# EAGLE design xx_backplane_shield_xi (EAGLE 8.5.2)
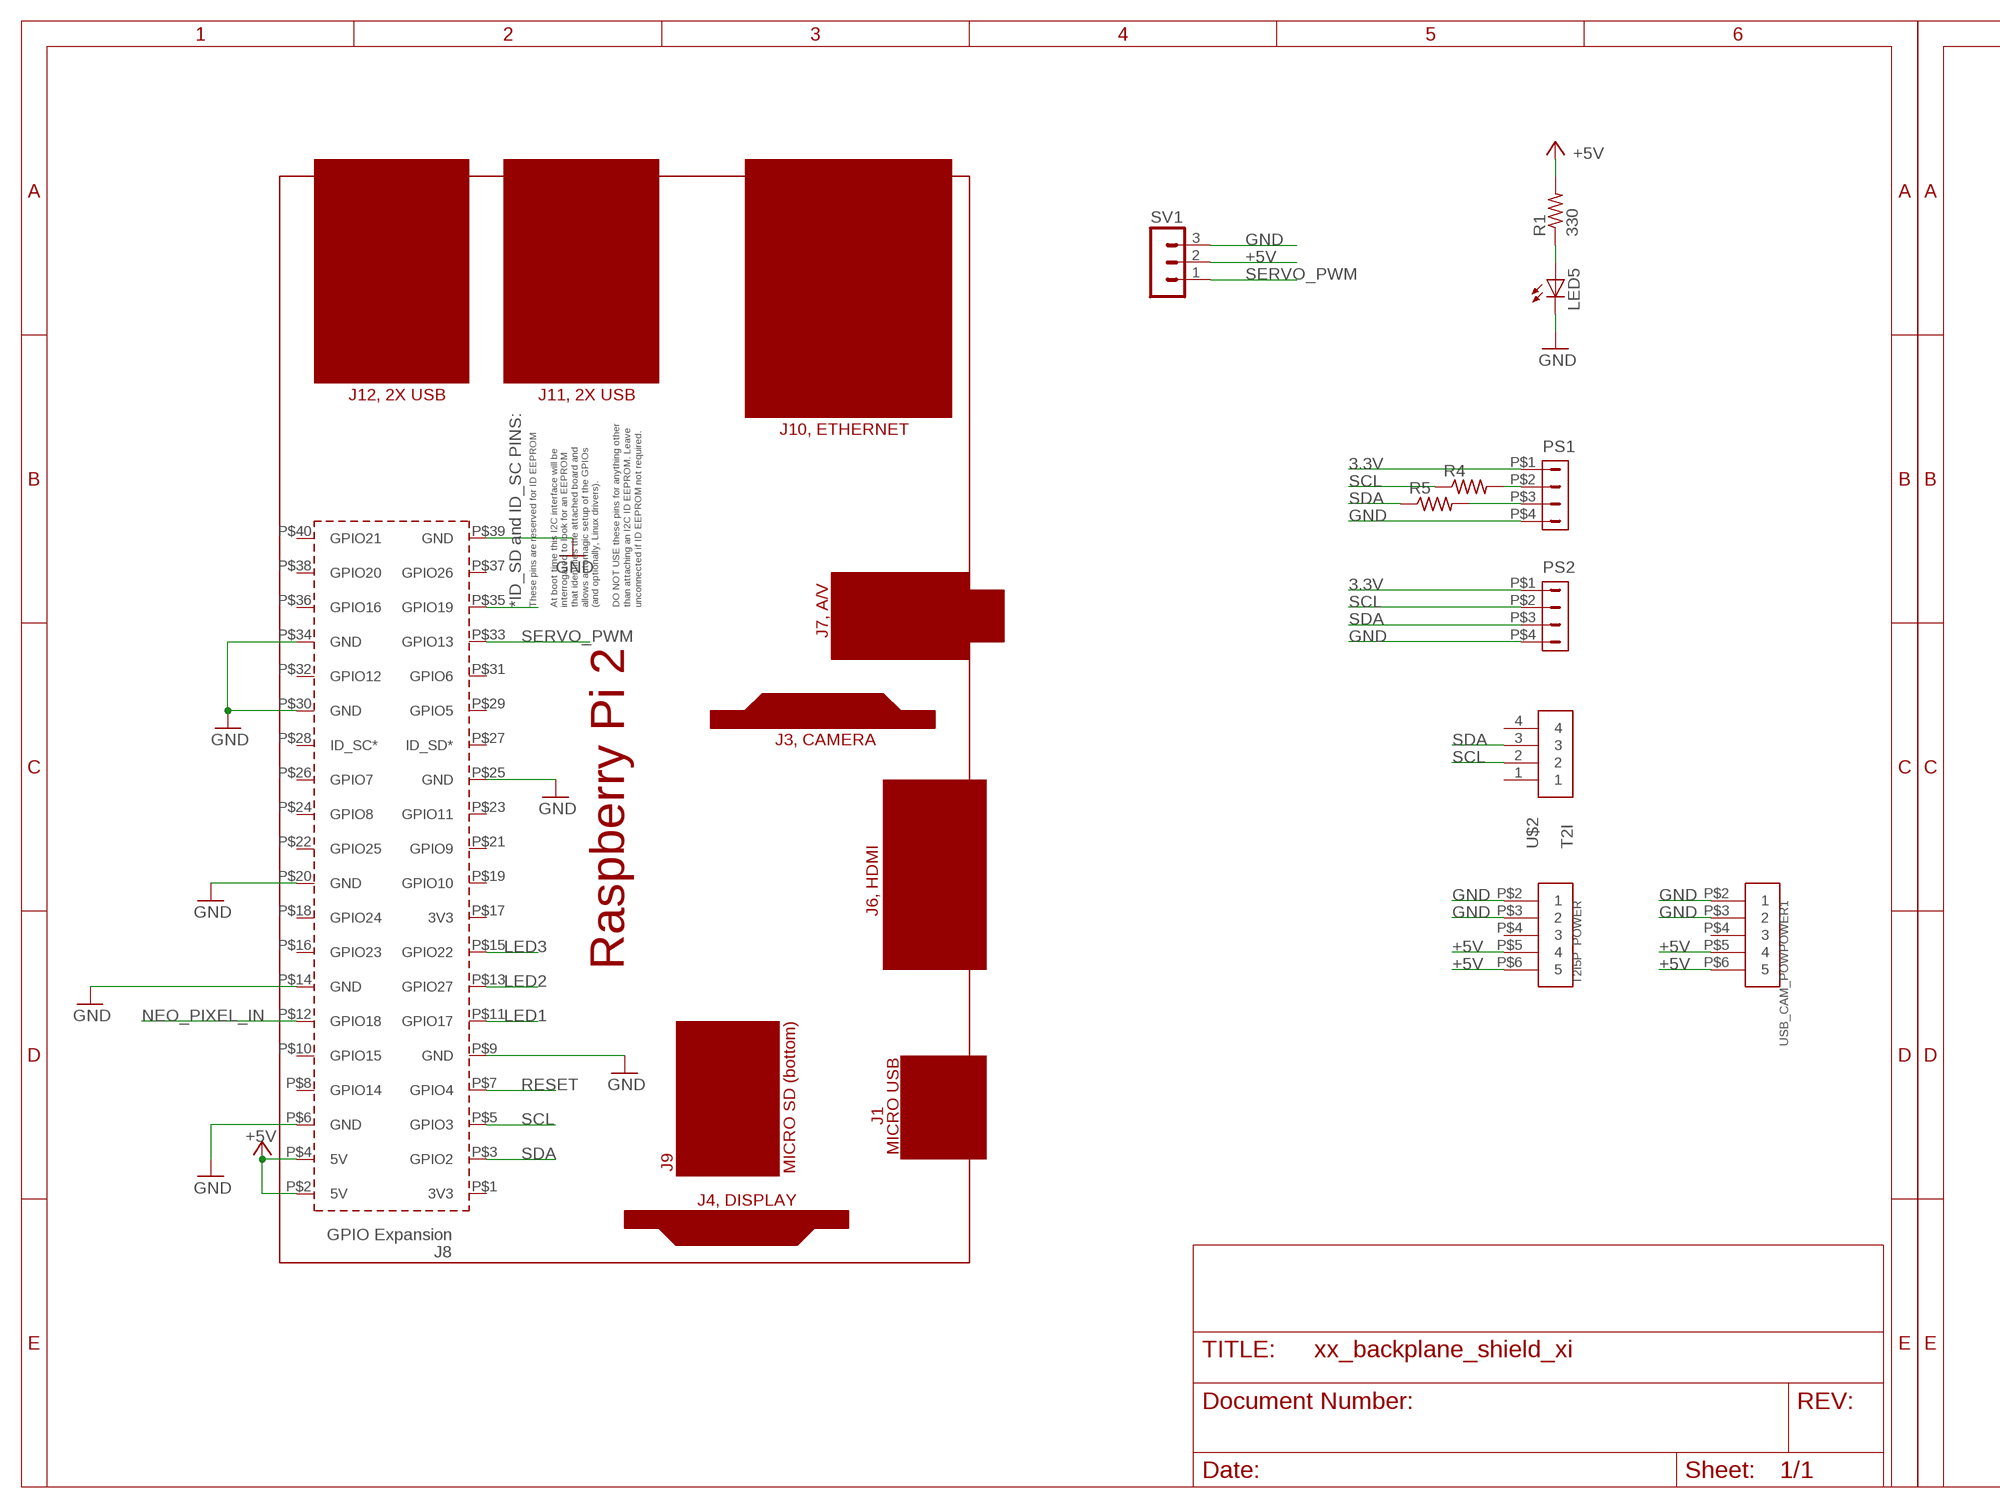
[diagram p0: schematic, sheet 1, part 1 of 2]
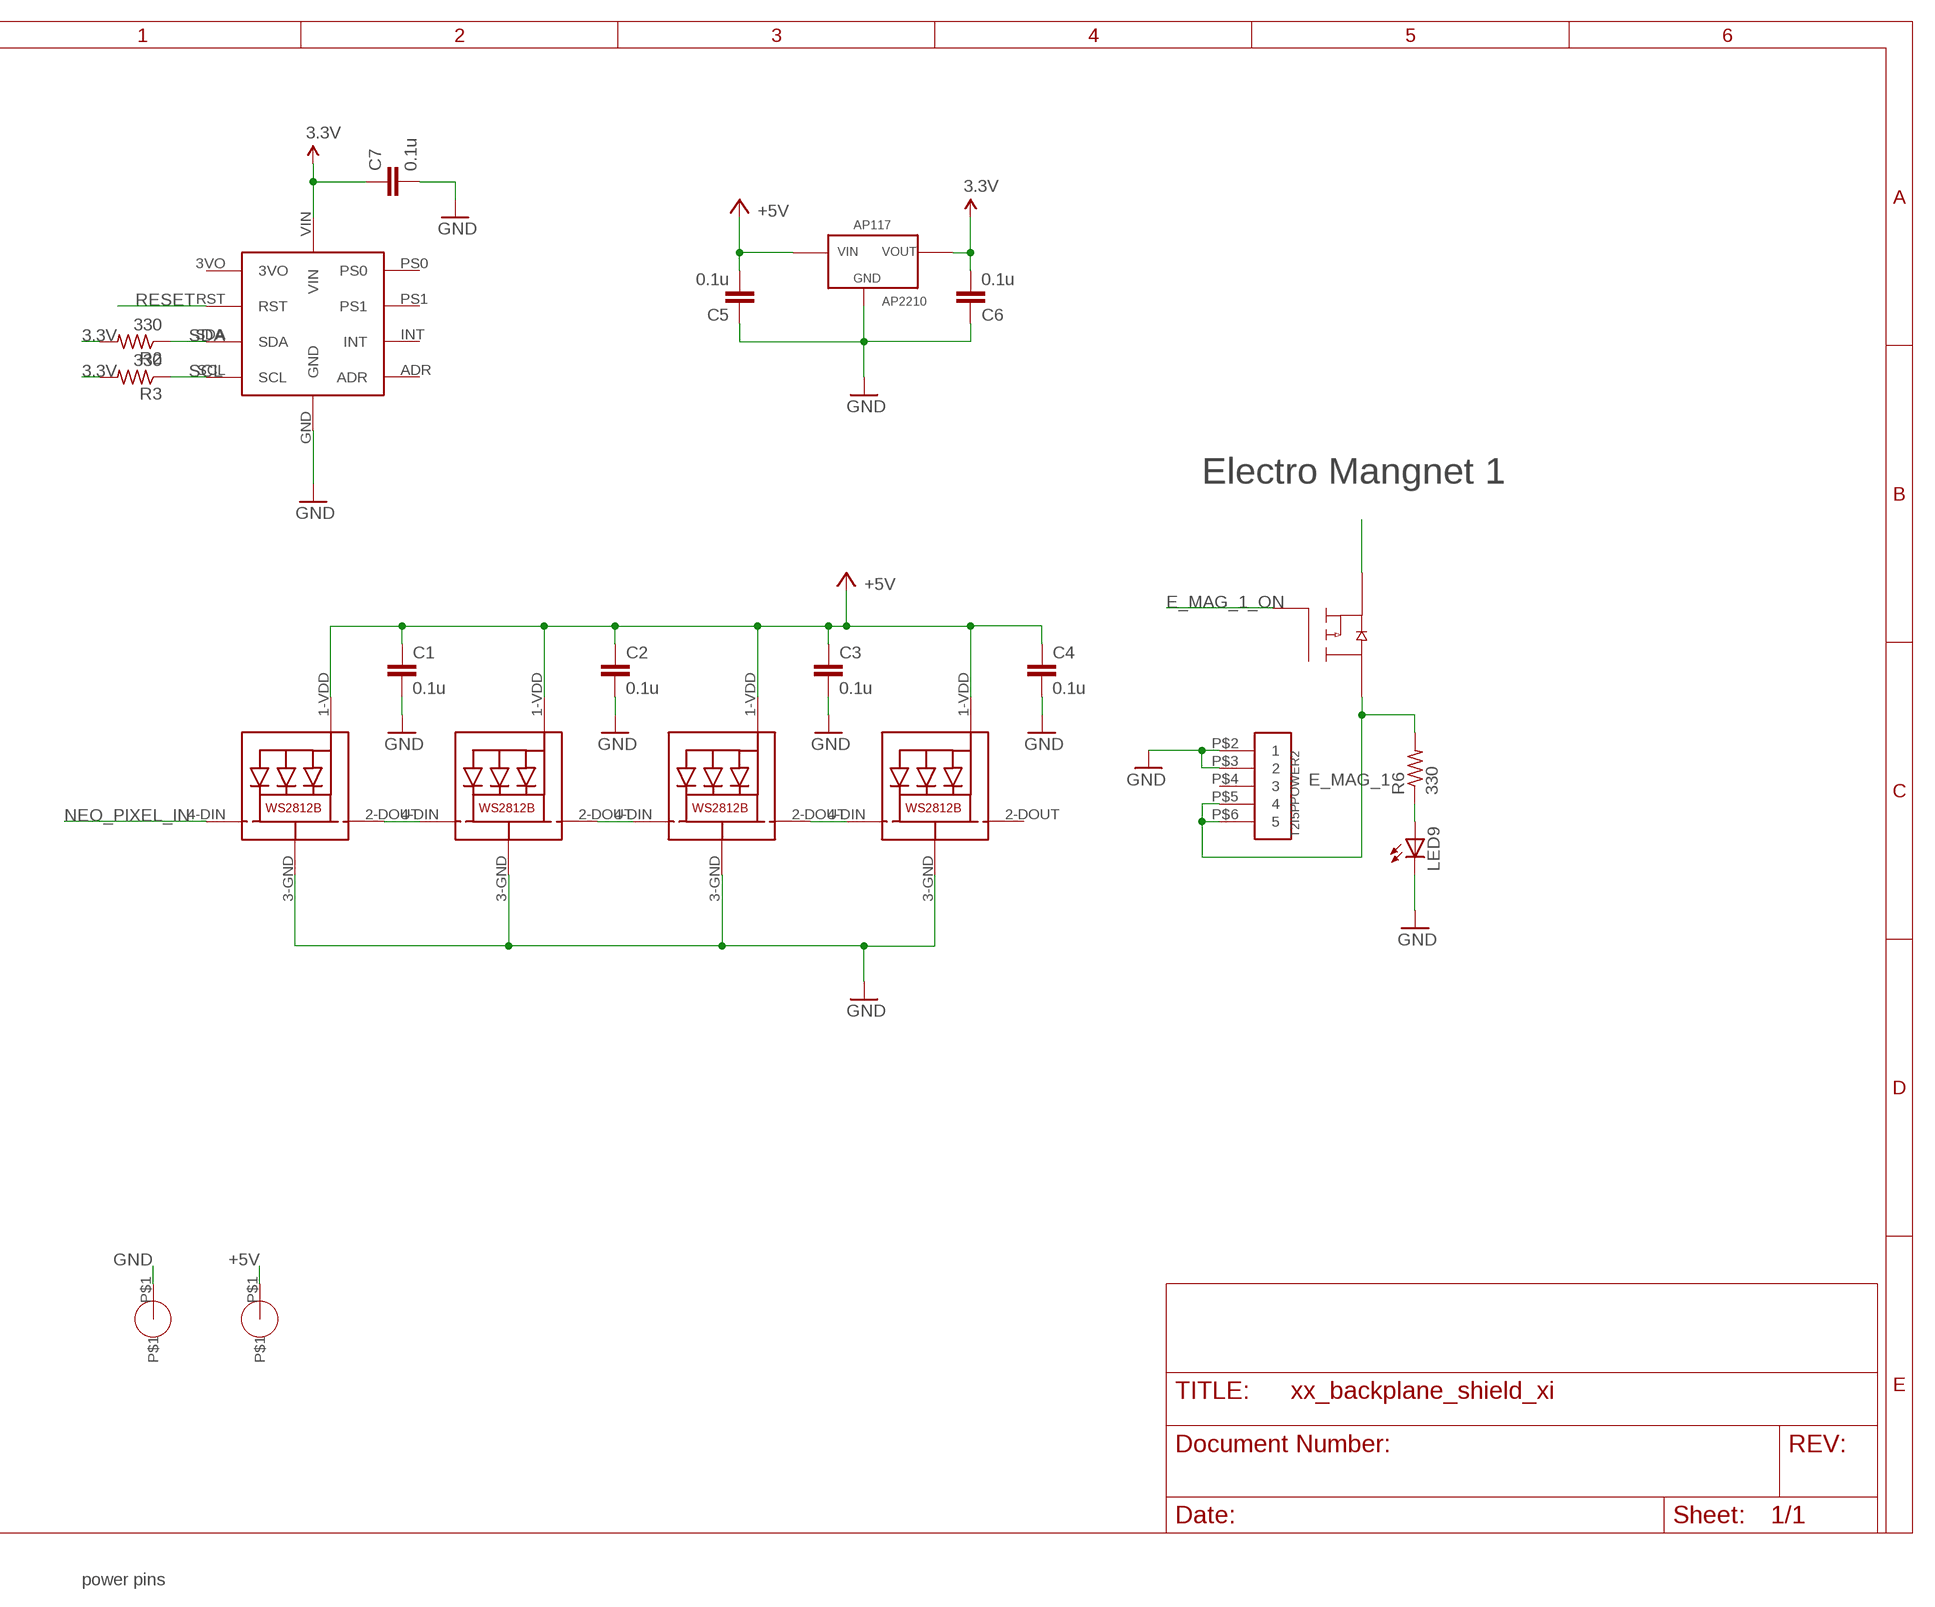
[diagram p1: schematic, sheet 1, part 2 of 2]

## Parts
C1  0.1u  CAP0603-CAP  [0603-CAP]
C2  0.1u  CAP0603-CAP  [0603-CAP]
C3  0.1u  CAP0603-CAP  [0603-CAP]
C4  0.1u  CAP0603-CAP  [0603-CAP]
C5  0.1u  CAP0603-CAP  [0603-CAP]
C6  0.1u  CAP0603-CAP  [0603-CAP]
C7  0.1u  CAP0603-CAP  [0603-CAP]
LED1  WS2812B5050  [WS2812B]
LED2  WS2812B5050  [WS2812B]
LED3  WS2812B5050  [WS2812B]
LED4  WS2812B5050  [WS2812B]
LED5  LEDSML0603  [SML0603]
LED9  LEDSML0603  [SML0603]
PCB1  RPI2  [RPI2]
POWER  T2I5P  [T2I5P]
POWER1  USB_CAM_POW  T2I5P  [T2I5P]
POWER2  T2I5P  [T2I5P]
PS1  DF13-4P-1.25DSA  [DF13-4P-1.25DSA]
PS2  DF13-4P-1.25DSA  [DF13-4P-1.25DSA]
R1  330  R-US_R0603  [R0603]
R2  330  R-US_R0603  [R0603]
R3  330  R-US_R0603  [R0603]
R4  0 Ohms  R-US_R0603  [R0603]
R5  0 ohms  R-US_R0603  [R0603]
R6  330  R-US_R0603  [R0603]
SV1  MA03-1  [MA03-1]
U1  FQB27P06  [TO263-3]
U$2  T2I  [T2I]
U$3  BNO055_9DOF_BREAKOUT  [BNO055]
U$4  THROUGHOLE  [THROUGHHOLE]
U$5  AP2210  [SOT-23-3]
U$6  THROUGHOLE  [THROUGHHOLE]

## Nets
3.3V: C6.2 C7.1 PS1.P$1 PS2.P$1 R2.2 R3.2 U$3.VIN U$5.VOUT
+5V: C1.1 C2.1 C3.1 C4.1 C5.2 LED1.1-VDD(VDD) LED2.1-VDD(VDD) LED3.1-VDD(VDD) LED4.1-VDD(VDD) PCB1.P$2(5V) PCB1.P$4(5V) POWER1.P$5 POWER1.P$6 POWER.P$5 POWER.P$6 R1.2 SV1.2 U1.3(S2) U$4.P$1 U$5.VIN
E_MAG_1: POWER2.P$5 POWER2.P$6 R6.2 U1.TAB(D2)
E_MAG_1_ON: PCB1.P$35(GPIO19) U1.1(G2)
GND: C1.2 C2.2 C3.2 C4.2 C5.1 C6.1 C7.2 LED1.3-GND(GND) LED2.3-GND(GND) LED3.3-GND(GND) LED4.3-GND(GND) LED5.C LED9.C PCB1.P$6(GND) PCB1.P$9(GND) PCB1.P$14(GND) PCB1.P$20(GND) PCB1.P$25(GND) PCB1.P$30(GND) PCB1.P$34(GND) PCB1.P$39(GND) POWER1.P$2 POWER1.P$3 POWER2.P$2 POWER2.P$3 POWER.P$2 POWER.P$3 PS1.P$4 PS2.P$4 SV1.3 U$3.GND U$5.GND U$6.P$1
LED1: PCB1.P$11(GPIO17)
LED2: PCB1.P$13(GPIO27)
LED3: PCB1.P$15(GPIO22)
N$1: PS1.P$2 R4.2
N$2: LED5.A R1.1
N$3: LED1.2-DOUT(DO) LED2.4-DIN(DI)
N$4: LED2.2-DOUT(DO) LED3.4-DIN(DI)
N$5: LED3.2-DOUT(DO) LED4.4-DIN(DI)
N$8: PS1.P$3 R5.2
N$51: LED9.A R6.1
NEO_PIXEL_IN: LED1.4-DIN(DI) PCB1.P$12(GPIO18)
RESET: PCB1.P$7(GPIO4) U$3.RST
SCL: PCB1.P$5(GPIO3) PS2.P$2 R3.1 R4.1 U$2.2 U$3.SCL
SDA: PCB1.P$3(GPIO2) PS2.P$3 R2.1 R5.1 U$2.3 U$3.SDA
SERVO_PWM: PCB1.P$33(GPIO13) SV1.1
Unconnected: LED4.2-DOUT(DO) PCB1.P$1(3V3) PCB1.P$8(GPIO14) PCB1.P$10(GPIO15) PCB1.P$16(GPIO23) PCB1.P$17(3V3) PCB1.P$18(GPIO24) PCB1.P$19(GPIO10) PCB1.P$21(GPIO9) PCB1.P$22(GPIO25) PCB1.P$23(GPIO11) PCB1.P$24(GPIO8) PCB1.P$26(GPIO7) PCB1.P$27(ID_SD*) PCB1.P$28(ID_SC*) PCB1.P$29(GPIO5) PCB1.P$31(GPIO6) PCB1.P$32(GPIO12) PCB1.P$36(GPIO16) PCB1.P$37(GPIO26) PCB1.P$38(GPIO20) PCB1.P$40(GPIO21) POWER1.P$4 POWER2.P$4 POWER.P$4 U$2.1 U$2.4 U$3.3VO U$3.ADR U$3.INT U$3.PS0 U$3.PS1

## Notes on the sheet
- Electro Mangnet 1
- power pins

## Library data of the parts
C1-C7 = SparkFun-Passives:CAP: Capacitor Standard 0603 ceramic capacitor, and 0.1" leaded capacitor.
LED1-LED4 = microbuilder:WS2812B5050
LED5 LED9 = led:LED: LED OSRAM: - CHIPLED LG R971, LG N971, LY N971, LG Q971, LY Q971, LO R971, LY R971 LH N974, LH R974 LS Q976, LO Q976, LY Q976 LO Q996 - Hyper CHIPLED LW Q18S LB Q993, LB Q99A, LB R99A - SideLED LS A670, LO A670, LY A670, LG A670, LP A670 LB A673, LV A673, LT A673, LW A673 LH A674 LY A675 LS A676, LA A676, LO A676, LY A676, LW A676 LS A679, LY A679, LG A679 - Hyper Micro SIDELED® LS Y876, LA Y876, LO Y876, LY Y876 LT Y87S - SmartLED LW L88C, LW L88S LB L89C, LB L89S, LG L890 LS L89K, LO L89K, LY L89K LS L896, LA L896, LO L896, LY L896 - TOPLED LS T670, LO T670, LY T670, LG T670, LP T670 LSG T670, LSP T670, LSY T670, LOP T670, LYG T670 LG T671, LOG T671, LSG T671 LB T673, LV T673, LT T673, LW T673 LH T674 LS T676, LA T676, LO T676, LY T676, LB T676, LH T676, LSB T676, LW T676 LB T67C, LV T67C, LT T67C, LS T67K, LO T67K, LY T67K, LW E67C LS E67B, LA E67B, LO E67B, LY E67B, LB E67C, LV E67C, LT E67C LW T67C LS T679, LY T679, LG T679 LS T770, LO T770, LY T770, LG T770, LP T770 LB T773, LV T773, LT T773, LW T773 LH T774 LS E675, LA E675, LY E675, LS T675 LS T776, LA T776, LO T776, LY T776, LB T776 LHGB T686 LT T68C, LB T68C - Hyper Mini TOPLED® LB M676 - Mini TOPLED Santana® LG M470 LS M47K, LO M47K, LY M47K Source: http://www.osram.convergy.de LUXEON: - LUMILED® LXK2-PW12-R00, LXK2-PW12-S00, LXK2-PW14-U00, LXK2-PW14-V00 LXK2-PM12-R00, LXK2-PM12-S00, LXK2-PM14-U00 LXK2-PE12-Q00, LXK2-PE12-R00, LXK2-PE12-S00, LXK2-PE14-T00, LXK2-PE14-U00 LXK2-PB12-K00, LXK2-PB12-L00, LXK2-PB12-M00, LXK2-PB14-N00, LXK2-PB14-P00, LXK2-PB14-Q00 LXK2-PR12-L00, LXK2-PR12-M00, LXK2-PR14-Q00, LXK2-PR14-R00 LXK2-PD12-Q00, LXK2-PD12-R00, LXK2-PD12-S00 LXK2-PH12-R00, LXK2-PH12-S00 LXK2-PL12-P00, LXK2-PL12-Q00, LXK2-PL12-R00 Source: www.luxeon.com KINGBRIGHT: KA-3528ASYC Source: www.kingbright.com
PCB1 = MicrocontrollerComponents:RPI2: Device for Raspberry Pi 2 board created by www.element14.com More information and support community is available at http://www.element14.com/community/community/raspberry-pi/raspberrypi2
POWER POWER1 POWER2 = T2I5P:T2I5P
PS1 PS2 = con-hirose-df13:DF13-4P-1.25: DF13-4P 1.25mm Pitch Miniature Crimping Connector.
R1-R6 = resistor:R-US_: RESISTOR, American symbol
SV1 = con-lstb:MA03-1: PIN HEADER; OC_FARNELL: unknown; OC_NEWARK: unknown
U1 = CamSensComponents:FQB27P06
U$2 = BackplaneParts:T2I
U$3 = Other:BNO055_9DOF_BREAKOUT
U$4 U$6 = throughhole:THROUGHOLE
U$5 = PowerComponents:AP2210

## Board
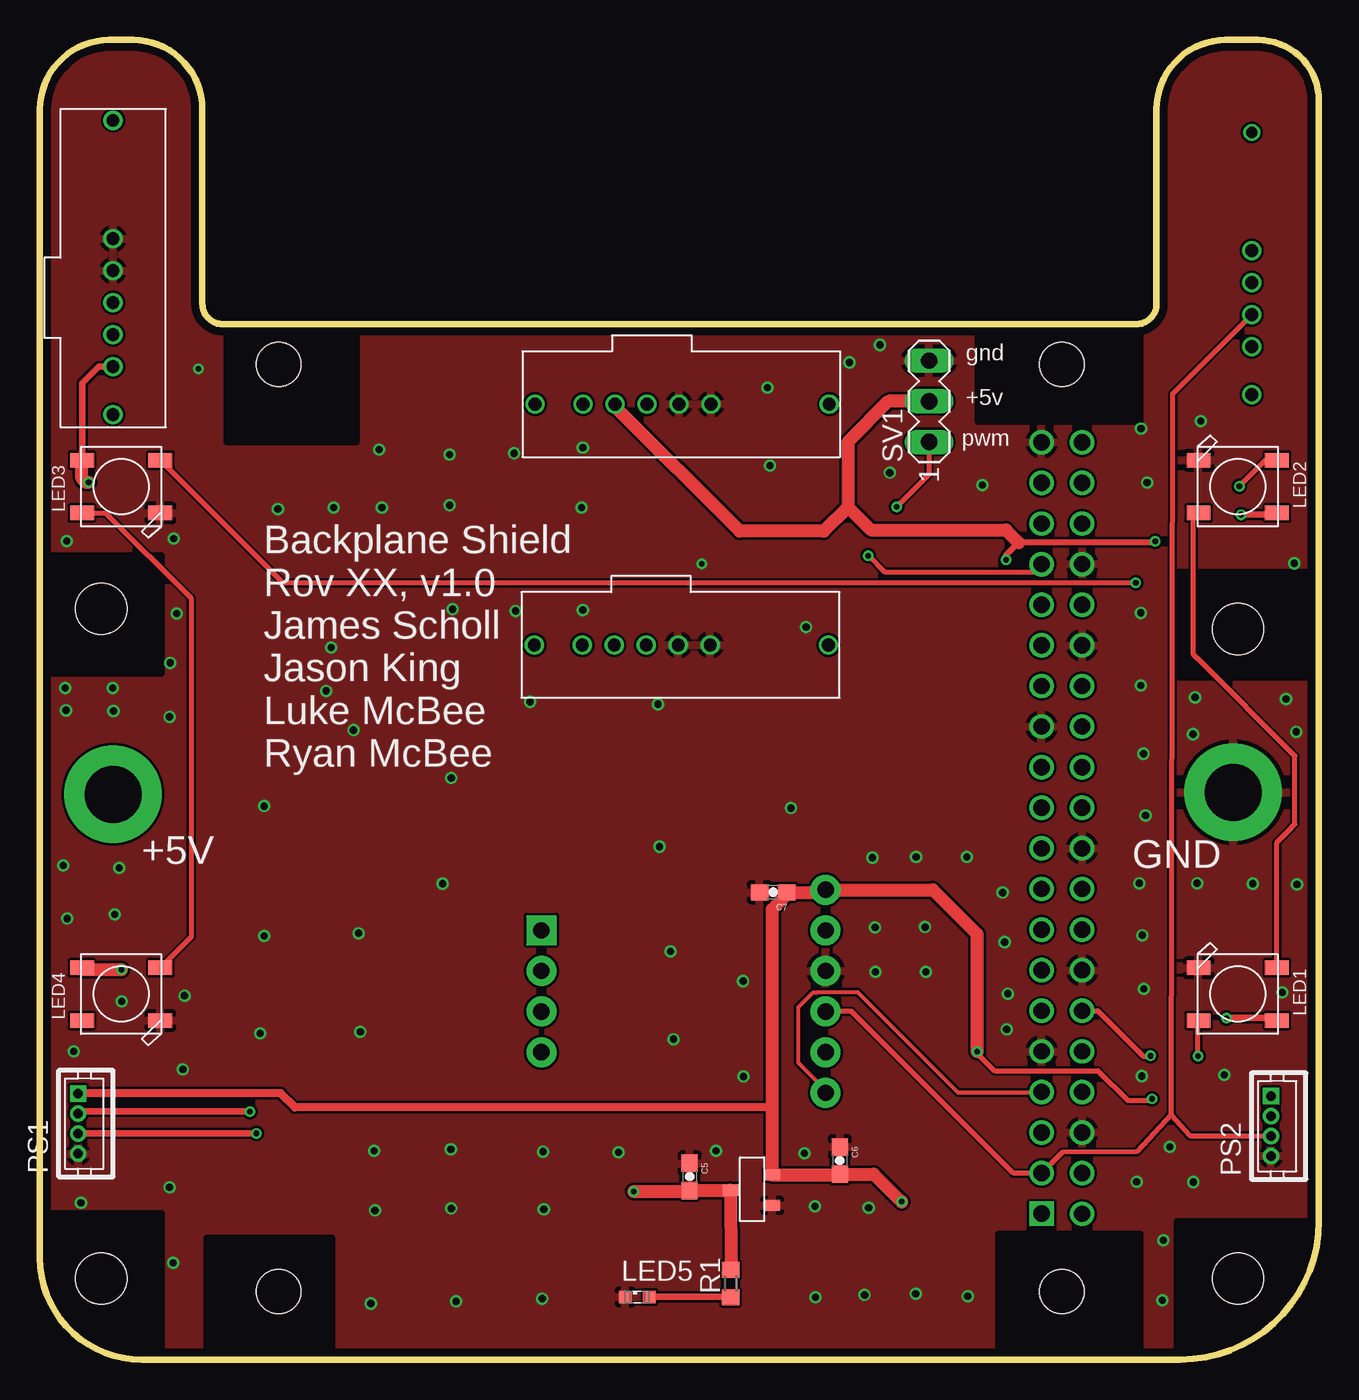
[diagram p2: board, top side]
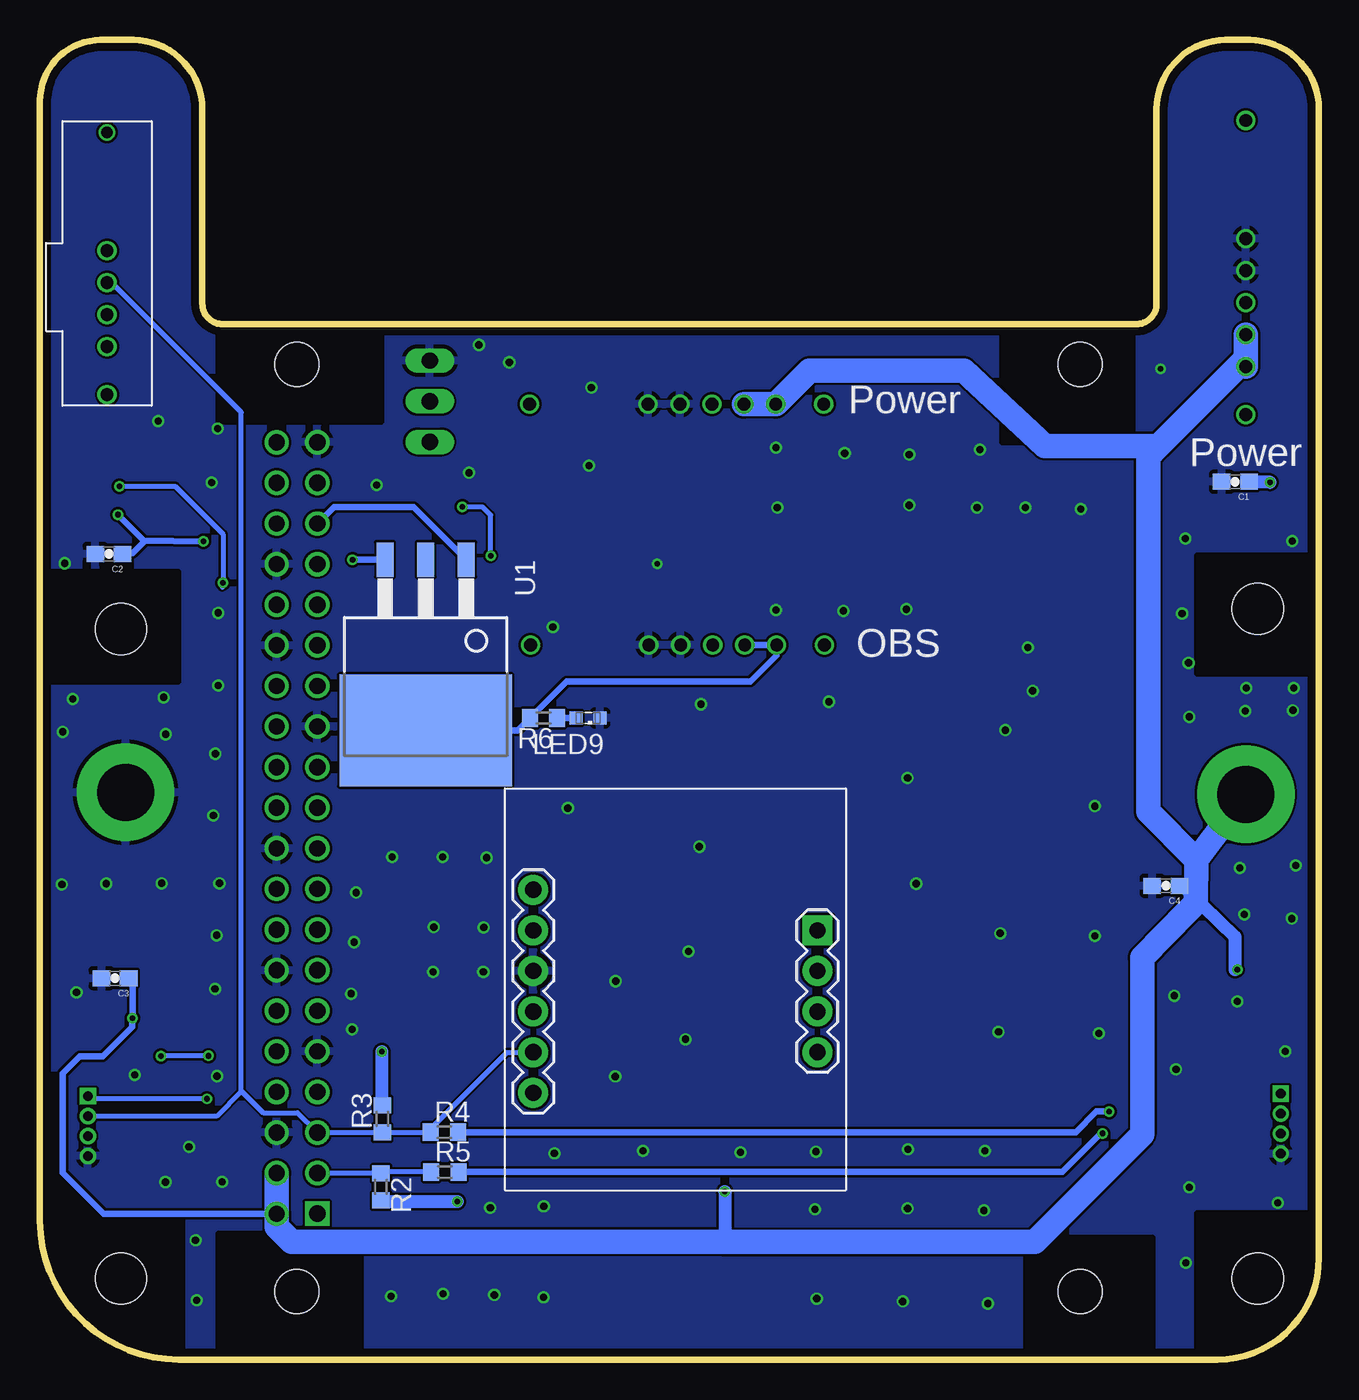
[diagram p3: board, bottom side, seen from below]

Size 80.01 x 82.55 mm. Coordinates in mm from the lower left corner, seen from the top.
Outline: 10.16,78.21 10.16,66.04 arc90 11.43,64.77 68.58,64.77 arc90 69.85,66.04 69.85,78.21 arc-90 74.19,82.55 76.2,82.55 arc-90 80.01,78.74 80.01,8.67 arc-90 71.34,0 6.35,0 arc-90 0,6.35 0,78.21 arc-90 4.34,82.55 5.82,82.55 arc-90 10.16,78.21
Copper layers (1*16): Top 0.035mm / dielectric 1.6mm / Bottom 0.035mm
Design rules "Elecrow_2-layer_PCB_eagle_rule": minimum track width 6mil, minimum drill 12mil, track to track 6mil, track to pad 6mil, pad to pad 6mil, via to via 8mil, smd to smd 0mil, copper to edge 20mil, drill to drill 10mil, minimum pad ring 6mil, minimum via ring 6mil, stop-mask expansion 0mil, vias tented up to drill 100mil, thermal gap 10mil
Holes 3.2 mm at 3.82,5.06 74.94,5.06 3.82,46.97 74.94,45.7

### Footprints (pad centres in the part's own frame; a part is rotated, then mirrored left to right if it is on the bottom)
0603-CAP = smd 1.1 x 1: 1 -0.85,0; 2 0.85,0
WS2812B = smd 1.5 x 0.9: 1-VDD 2.45,-1.65; 2-DOUT 2.45,1.65; 3-GND -2.45,1.65; 4-DIN -2.45,-1.65
SML0603 = smd 0.8 x 0.8: A 0.75,0; C -0.75,0
RPI2 = drill 1.016 square: P$1 8.37,51.23 | drill 1.016: P$2 8.357,53.772; P$3 10.897,51.232; P$4 10.897,53.772; P$5 13.437,51.232; P$6 13.437,53.772; P$7 15.977,51.232; P$8 15.977,53.772; P$9 18.517,51.232; P$10 18.517,53.772; P$11 21.057,51.232; P$12 21.057,53.772; P$13 23.597,51.232; P$14 23.597,53.772; P$15 26.137,51.232; P$16 26.137,53.772; P$17 28.677,51.232; P$18 28.677,53.772; P$19 31.217,51.232; P$20 31.217,53.772; P$21 33.757,51.232; P$22 33.757,53.772; P$23 36.297,51.232; P$24 36.297,53.772; P$25 38.837,51.232; P$26 38.837,53.772; P$27 41.377,51.232; P$28 41.377,53.772; P$29 43.917,51.232; P$30 43.917,53.772; P$31 46.457,51.232; P$32 46.457,53.772; P$33 48.997,51.232; P$34 48.997,53.772; P$35 51.537,51.232; P$36 51.537,53.772; P$37 54.077,51.232; P$38 54.077,53.772; P$39 56.617,51.232; P$40 56.617,53.772 | hole 2.75: 3.5,3.5; 61.5,3.5; 3.5,52.5; 61.5,52.5
T2I5P = drill 0.8: P$1 -19.1,3.3; P$2 -11.7,3.3; P$3 -9.7,3.3; P$4 -7.7,3.3; P$5 -5.7,3.3; P$6 -3.7,3.3; P$7 -0.7,3.3
DF13-4P-1.25DSA = drill 0.6 pad 1.016 square: P$1 1.875,0 | drill 0.6 pad 1.016: P$2 0.625,0; P$3 -0.625,0; P$4 -1.875,0
R0603 = smd 1 x 1.1: 1 -0.85,0; 2 0.85,0
MA03-1 = drill 1.016 long: 1 -2.54,0; 2 0,0; 3 2.54,0
TO263-3 = smd 1.067 x 2.159: 1 -2.54,-5.08; 2 0,-5.08; 3 2.54,-5.08 | smd 10.795 x 6.985: TAB 0,5.601
T2I = drill 0.8: 1 8.1,2.8; 2 10.1,2.8; 3 12.1,2.8; 4 14.1,2.8; S2 17.1,2.8 | drill 0.7: S1 0.7,2.8
BNO055 = drill 1.016 pad 1.88: 3VO -8.89,2.54; ADR 8.89,-5.08; GND -8.89,0; INT 8.89,-2.54; PS1 8.89,0; RST -8.89,-7.62; SCL -8.89,-5.08; SDA -8.89,-2.54; VIN -8.89,5.08 | drill 1.016 pad 1.88 square: PS0 8.89,2.54
THROUGHHOLE = drill 3.556 pad 6.096: P$1 0,0
SOT-23-3 = smd 0.7 x 1: GND 0,0; VIN 0.95,2.6; VOUT 1.9,0

### Placement (x,y rotation side)
C1  5.23,54.91 180 bottom
C2  75.69,50.39 180 bottom
C3  75.31,23.85 180 bottom
C4  9.58,29.64 180 bottom
C5  40.64,11.43 270 top
C6  50.04,12.45 270 top
C7  45.87,29.24 180 top
LED1  74.93,22.86 0 top
LED2  74.93,54.61 0 top
LED3  5.08,54.61 180 top
LED4  5.08,22.86 180 top
LED5  37.36,3.91 0 top
LED9  45.72,40.13 180 bottom
PCB1  11.43,0.76 90 bottom
POWER  1.27,58.42 270 top
POWER1  30.28,63.07 180 top
POWER2  30.23,48.01 180 top
PS1  2.39,14.76 90 top
PS2  77.01,14.61 90 top
R1  43.21,4.75 90 top
R2  58.67,10.8 270 bottom
R3  58.6,15.06 90 bottom
R4  54.71,14.22 0 bottom
R5  54.69,11.73 0 bottom
R6  48.51,40.13 180 bottom
SV1  55.63,59.94 90 top
U1  55.88,44.96 180 bottom
U$2  78.61,77.47 270 bottom
U$3  40.26,24.31 0 bottom
U$4  4.57,35.36 0 top
U$5  45.8,9.65 90 top
U$6  74.65,35.48 0 top

### Tracks (layer width: path | path; a pad name or v marks a point on that pad's centre or on a via)
3.3V  (via drill 0.35)
  Top 0.305: v53.9,9.88 54.1,9.88 | v58.62,19.25 58.62,19.15 59.72,18.06 66.19,18.06 68.05,16.2 69.47,16.2 v69.57,16.31
  Top 0.406: 46.86,29.24 C7.1 | 49,29.24 U$3.VIN
  Top 0.508: 45.8,15.77 15.95,15.77 15.06,16.66 2.42,16.66 PS1.P$1
  Top 0.813: 46.86,29.24 45.8,28.17 45.8,15.77 U$5.VOUT 49.99,11.55 C6.2 52.16,11.6 53.9,9.86 v53.9,9.88 | C7.1 49,29.24 | U$3.VIN 55.86,29.39 58.62,26.62 v58.62,19.25
  Bottom 0.305: v69.57,16.31 76.84,16.31 PS2.P$1
  Bottom 0.813: v58.62,19.25 58.62,15.93 R3.2 | v53.9,9.88 58.61,9.88 R2.2
+5V  (via drill 0.35)
  Top 0.406: 43.11,10.52 U$5.VIN | 43.22,5.82 R1.2 | POWER.P$6 3.68,62.12 2.64,61.09 2.64,56.27 LED3.1-VDD | v69.77,51.18 69.77,51.16 69.72,51.13 61.21,51.11 60.45,50.34 v60.45,50.04 | v75.13,52.86 77.28,52.86 LED2.1-VDD | v74.22,21.36 77.23,21.36 LED1.1-VDD | 2.76,24.38 LED4.1-VDD
  Top 0.813: U$5.VIN 43.22,5.82 | 61.21,51.11 60.43,51.89 51.99,51.89 50.55,53.34 | v5.11,24.38 2.76,24.38 | v3.05,54.86 2.87,54.86 2.62,55.12 2.62,56.25 LED3.1-VDD | POWER1.P$5 35.98,59.63 43.79,51.82 49.02,51.82 50.55,53.34 | v37.16,10.52 40.58,10.52 C5.2 43.05,10.58 43.11,10.52 | SV1.2 53.09,59.94 50.55,57.4 50.55,53.34
  Bottom 0.406: 37.16,10.46 37.11,10.52 v37.16,10.52 | v69.77,51.18 73.51,51.23 | 73.51,51.23 v75.13,52.86 | PCB1.P$2 76.02,9.12 78.59,11.68 78.59,17.91 77.52,18.97 76.07,18.97 74.24,20.8 74.24,21.34 v74.22,21.36 74.22,23.61 C3.1 | 8.17,28.11 7.25,28.39 | 5.26,24.38 v5.11,24.38 | 73.51,51.23 73.51,51.16 74.22,50.44 74.79,50.44 C2.1 | C4.1 8.73,29.58 7.71,28.56 | U1.3 v60.45,50.04
  Bottom 0.813: 7.25,28.39 5.26,26.44 5.26,24.38 | C1.1 3.12,54.92 3.07,54.86 v3.05,54.86 | v37.16,10.52 37.16,7.54 37.34,7.37
  Bottom 1.016: 65.15,9.07 PCB1.P$2
  Bottom 1.524: POWER.P$5 POWER.P$6 4.57,62.61 10.03,57.15 | 10.03,57.15 17.15,57.15 22.23,61.87 31.87,61.87 POWER1.P$6 POWER1.P$5 | 7.66,31.25 7.71,28.56 8.17,28.11 11.05,25.15 11.05,14.1 17.78,7.37 37.34,7.37 64.26,7.37 65.2,8.31 PCB1.P$2 PCB1.P$4 | 7.66,31.25 U$4.P$1 | 10.03,57.15 10.68,56.5 10.68,34.28 7.66,31.25
E_MAG_1
  Bottom 0.406: U1.TAB 50.14,39.36 R6.2 47.08,42.42 35.56,42.42 33.93,44.05 POWER2.P$6 | POWER2.P$6 | POWER2.P$5 POWER2.P$6
E_MAG_1_ON
  Bottom 0.406: U1.1 56.64,53.34 61.62,53.34 PCB1.P$35
GND  (via drill 0.35, 0.45)
  other vias: 18.36,53.29 21.39,53.29 25.63,53.44 33.88,53.29 29.67,56.69 25.63,56.62 21.21,56.92 14.88,53.21 33.96,57.05 14.02,34.62 18.21,44.55 17.91,41.83 19.61,39.37 25.2,29.77 25.73,36.37 30.66,41.15 38.66,41 47.93,45.82 46.99,34.49 14.02,26.49 19.94,26.67 13.77,20.4 20.04,20.5 39.45,25.53 39.62,20.04 20.95,9.32 25.73,9.45 20.9,13.06 8.1,10.77 8.33,6.05 20.7,3.51 26.04,3.63 45.67,55.93 45.52,60.81 52.55,63.47 53.16,55.47 50.65,62.38 58.95,54.71 68.88,58.24 69.27,54.86 72.62,58.7 78.46,49.81 68.86,46.71 72.26,41.43 77.95,41.33 78.59,39.27 72.14,39.12 68.86,42.16 69.04,37.9 69.16,34.04 68.78,29.79 72.39,29.79 75.87,29.77 78.64,29.72 68.96,26.54 69.06,23.19 52.25,27.03 55.37,27.05 52.27,24.26 55.42,24.26 52.07,31.39 54.81,31.45 57.99,31.45 60.22,29.21 60.35,26.11 60.55,22.89 60.48,20.65 38.76,32.08 43.99,23.67 44.02,17.7 1.68,51.21 8.36,51.36 8.56,46.66 8.15,43.59 8.1,40.21 4.6,40.56 4.55,42.01 1.57,42.01 1.63,40.61 1.45,30.91 4.95,30.76 1.7,27.58 4.67,27.84 8.94,18.16 9.04,22.76 2.11,19.28 5.11,22.4 2.57,9.8 25.81,46.94 29.74,46.84 33.96,46.89 25.7,13.16 31.47,13 31.52,9.4 31.42,3.81 36.2,12.95 42.29,13.06 47.83,12.9 48.49,9.58 48.51,3.89 51.84,9.5 51.59,4.04 54.79,4.11 58.04,3.96 70.21,3.71 68.61,11.13 72.16,11.1 70.69,13.31 70.28,7.47 74.09,17.81 68.94,17.73 77.72,22.96 41.4,49.78 9.91,61.98
  pour Top: -17.78,96.52 -20.32,-19.05 96.52,-19.05 97.79,97.79
  pour Bottom: -20.32,99.06 -21.59,-21.59 100.33,-21.59 100.33,99.06
N$1  (via drill 0.35)
  Top 0.406: v13.13,15.52 2.53,15.52 PS1.P$2
  Bottom 0.406: R4.2 15.21,14.22 13.92,15.52 v13.13,15.52
N$2
  Top 0.406: LED5.A 43.19,3.91 R1.1
N$3
  Top 0.305: LED1.2-DOUT 77.38,32.35 78.28,33.25 78.28,33.27 78.51,33.5 78.51,37.77 72.44,43.84 72.41,43.84 72.16,44.09 72.16,52.64 LED2.4-DIN
N$4  (via drill 0.35)
  Top 0.305: LED2.2-DOUT 76.66,56.26 v75.03,54.64 | v75.03,54.64 74.95,54.56 v75.03,54.64 | v68.56,48.59 15.2,48.59 LED3.4-DIN
  Bottom 0.305: v75.03,54.64 71.55,54.64 68.56,51.64 v68.56,48.59 | v68.56,48.59 68.56,48.36 68.61,48.31 68.61,48.54 v68.56,48.59
N$5
  Top 0.305: LED3.2-DOUT 4.11,52.96 9.45,47.62 9.45,26.43 LED4.4-DIN
N$6
  cutout Bottom: 11.68,64.77 19.81,64.77 19.81,57.4 11.68,57.4
N$7
  cutout Top: 11.68,64.77 19.81,64.77 19.81,57.4 11.68,57.4
N$8  (via drill 0.35)
  Top 0.406: v13.54,14.15 2.4,14.15 PS1.P$3
  Bottom 0.406: R5.2 16.05,11.73 13.61,14.17 13.56,14.17 v13.54,14.15
N$9
  cutout Top: 0,9.14 0,0 7.62,0 7.62,9.14
N$10
  cutout Top: 10.41,0 10.41,7.62 18.29,7.62 18.29,0
N$11
  cutout Top: 59.94,0 59.94,7.87 68.83,7.87 68.83,0
N$12
  cutout Top: 71.12,0.25 80.01,0.25 80.01,8.64 71.12,8.64
N$13
  cutout Top: 0,50.29 7.62,50.29 7.62,42.93 0,42.93
N$14
  cutout Top: 79.76,43.94 79.76,49.28 71.37,49.28 71.37,42.67 79.76,42.67
N$15
  cutout Top: 58.67,65.02 68.83,65.02 68.83,58.67 58.67,58.67
N$16
  cutout Bottom: 58.67,65.02 68.83,65.02 68.83,58.67 58.67,58.67
N$17
  cutout Bottom: 71.37,49.28 79.25,49.28 79.25,42.42 71.37,42.42
N$18
  cutout Bottom: 71.12,8.64 80.01,8.64 80.01,0.25 71.12,0.25
N$19
  cutout Bottom: 59.94,7.87 68.83,7.87 68.83,0 59.94,0
N$20
  cutout Bottom: 10.41,0 10.41,7.62 18.29,7.62 18.29,0
N$21
  cutout Bottom: 7.62,0 0,0 0,9.14 7.62,9.14
N$22
  cutout Bottom: 0,42.93 7.62,42.93 7.62,50.29 0,50.29
N$51
  Bottom 0.406: R6.1 LED9.A
NEO_PIXEL_IN  (via drill 0.35)
  Top 0.305: PCB1.P$12 66.17,21.82 69.01,18.97 69.44,18.97 v69.47,19 | v72.44,18.97 72.44,21.17 LED1.4-DIN
  Bottom 0.305: v69.47,19 72.29,19 72.37,18.92 72.39,18.92 v72.44,18.97
RESET
  Top 0.254: U$3.RST 49.15,16.87 47.45,18.57 47.45,22.05 48.36,22.96 48.62,22.96 48.64,22.99 51.16,22.99 57.43,16.71 62.64,16.71 PCB1.P$7
SCL
  Bottom 0.305: 67.41,16.82 67.41,59.26 75.52,67.37 U$2.2 | 67.41,16.82 66.04,15.44 63.91,15.44 PCB1.P$5 R3.1 55.58,14.2 R4.1 55.56,14.44 50.8,19.2 49.17,19.2 U$3.SCL | 67.41,16.82 67.41,16.76 68.96,15.21 77,15.21 PS2.P$2
SDA
  Top 0.305: 75.76,65.37 U$2.3 70.87,60.42 70.87,59.77 70.79,15.34 | 70.79,15.34 68.61,13 63.96,12.95 PCB1.P$3 60.91,11.66 50.77,21.79 49.17,21.79 U$3.SDA | 70.79,15.34 70.79,15.29 71.93,14 77,14 PS2.P$3
  Bottom 0.305: PCB1.P$3 62.65,11.65 R2.1 58.59,11.73 R5.1
SERVO_PWM  (via drill 0.35)
  Top 0.305: SV1.1 55.63,55.37 v53.59,53.34 | v51.82,50.29 52.83,49.28 62.18,49.28 PCB1.P$33
  Bottom 0.305: v53.59,53.34 52.32,53.34 51.82,52.83 v51.82,50.29

### Text on the board
tPlace: gnd | +5v | pwm | Backplane Shield / Rov XX, v1.0 / James Scholl / Jason King / Luke McBee / Ryan McBee | +5V | GND
bPlace: Power | Power | OBS